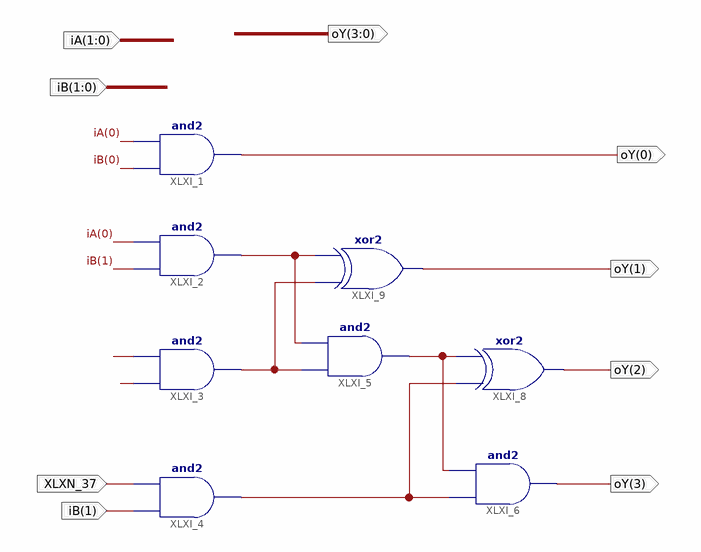
[diagram p0: schematic sheet 1]
// Xilinx ISE schematic Arithmetic2BitsMUL_sch.sch (spartan3a) as structural Verilog: 8 symbols, 9 ports
module Arithmetic2BitsMUL_sch (
  input  XLXN_37,
  input  [1:0] iB,
  input  [1:0] iA,
  output [3:0] oY
);

  wire o1, o2, o3, o4, XLXN_55;

  and XLXI_1 (oY[0], iB[0], iA[0]);
  xor XLXI_9 (oY[1], o3, o1);
  and XLXI_5 (o2, o3, o1);
  xor XLXI_8 (oY[2], o4, o2);
  and XLXI_6 (oY[3], o4, o2);
  and XLXI_2 (o1, iB[1], iA[0]);
  and XLXI_3 (o3, iB[0], XLXN_55);
  and XLXI_4 (o4, iB[1], XLXN_37);
endmodule
